# Altium project PowerSupply.PrjPcb (part 2 of 3)
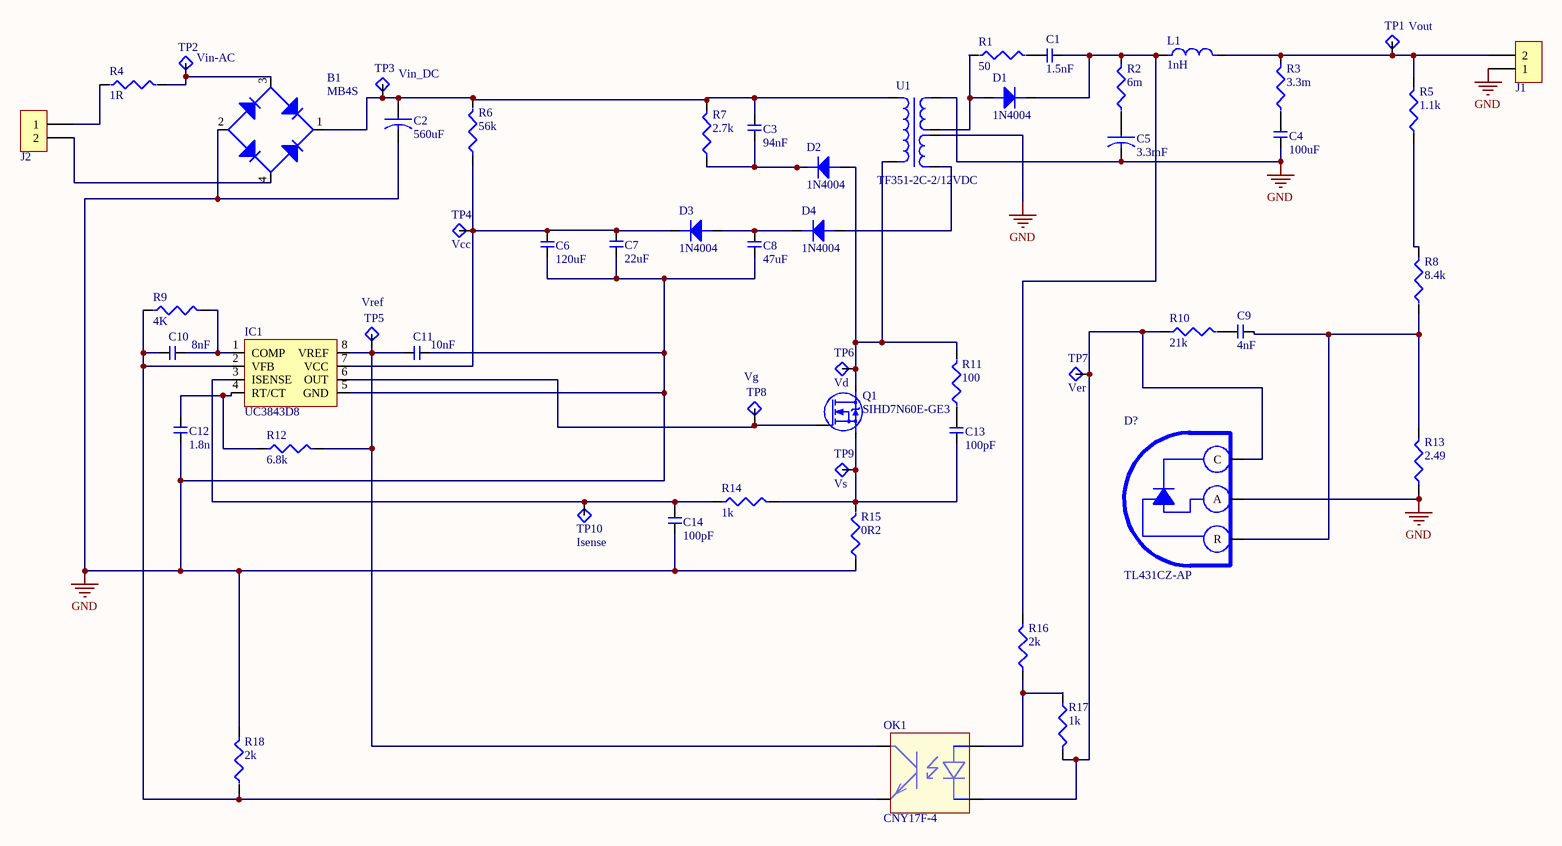
[diagram p1: PowerSupply.SchDoc]

## Sheet PowerSupply.SchDoc (continued)
### Library data of the parts
B1 = MB4S: Rectifier Bridge Diode Single 400V 0.5A 4-Pin SOIC N T/R / IC RECT BRIDGE 0.5A 400V 4SOIC; Manufacturer: ON Semiconductor / Fairchild; Supplier 1: Future Electronics; Manufacturer Part Number: MB4S; RoHS: Yes; Category: Rectifier Diodes; Stock 1: 6000; Pricing 1: 3000=0.114, 6000=0.111, 9000=0.11, 12000=0.109, 15000=0.106, 45000=0.106 (USD); Reverse Voltage: 400V; ComponentLink1URL: https://datasheet.ciiva.com/4433/mb4s-186124-4433195.pdf?src-supplier=Mouser; ComponentLink1Description: https://datasheet.ciiva.com/4433/mb4s-186124-4433195.pdf?src-supplier=Mouser; ComponentLink2URL: https://datasheet.ciiva.com/17038/mb4s-17038344.pdf?src-supplier=Future+Electronics; ComponentLink2Description: https://datasheet.ciiva.com/17038/mb4s-17038344.pdf?src-supplier=Future+Electronics; ComponentLink3URL: https://datasheet.ciiva.com/1197/1794557-1197746.pdf?src-supplier=Farnell; ComponentLink3Description: https://datasheet.ciiva.com/1197/1794557-1197746.pdf?src-supplier=Farnell; ComponentLink4URL: https://datasheet.ciiva.com/15145/getdatasheetpartid-117252-15145288.pdf?src-supplier=Verical; ComponentLink4Description: https://datasheet.ciiva.com/15145/getdatasheetpartid-117252-15145288.pdf?src-supplier=Verical; ComponentLink5URL: https://datasheet.ciiva.com/11195/mb8s-11195767.pdf?src-supplier=Avnet; ComponentLink5Description: https://datasheet.ciiva.com/11195/mb8s-11195767.pdf?src-supplier=Avnet; ComponentLink6URL: https://datasheet.ciiva.com/8018/1827136-8018971.pdf?src-supplier=Element14; ComponentLink6Description: https://datasheet.ciiva.com/8018/1827136-8018971.pdf?src-supplier=Element14; ComponentLink7URL: https://datasheet.ciiva.com/43505/974489-43505307.pdf?src-supplier=Jameco; ComponentLink7Description: https://datasheet.ciiva.com/43505/974489-43505307.pdf?src-supplier=Jameco; ComponentLink8URL: https://datasheet.ciiva.com/885/mb1s-885510.pdf?src-supplier=Digikey; ComponentLink8Description: https://datasheet.ciiva.com/885/mb1s-885510.pdf?src-supplier=Digikey; ComponentLink9URL: https://datasheet.ciiva.com/885/mb1s-885511.pdf?src-supplier=Digikey; ComponentLink9Description: https://datasheet.ciiva.com/885/mb1s-885511.pdf?src-supplier=Digikey; ComponentLink10URL: https://datasheet.ciiva.com/885/mb1s-885512.pdf?src-supplier=Digikey; ComponentLink10Description: https://datasheet.ciiva.com/885/mb1s-885512.pdf?src-supplier=Digikey; ComponentLink11URL: https://datasheet.ciiva.com/11195/mb8s-11195766.pdf?src-supplier=Avnet; ComponentLink11Description: https://datasheet.ciiva.com/11195/mb8s-11195766.pdf?src-supplier=Avnet
C1 = GRM21A5C2E152FWA1J: General Up to 125C Reflow soldering Flow soldering; Manufacturer: Murata; Supplier 1: Mouser; Manufacturer Part Number: GRM21A5C2E152FWA1J; RoHS: Yes; Category: Ceramic Capacitors; Stock 1: 9850; Pricing 1: 1=0.29, 10=0.206, 50=0.206, 100=0.124, 1000=0.078, 10000=0.064 (USD)
C2 = EEU-FM1C222: Aluminum Electrolytic Capacitor, Polarized, Aluminum (wet), 25V, 20% +Tol, 20% -Tol, 560uF; Manufacturer: Panasonic; Dissipation Factor: 18%; Voltage Rating (AC): 16V; Supplier 1: Mouser; Manufacturer Part Number: EEU-FM1C222; RoHS: Yes; Category: Aluminum Electrolytic Capacitors; Stock 1: 1570; Pricing 1: 1=1.04, 10=0.657, 50=0.657, 100=0.529, 1000=0.411, 10000=0.367 (USD); ComponentLink1URL: https://datasheet.ciiva.com/11778/0900766b805f3abe-11778660.pdf?src-supplier=Rs; ComponentLink1Description: https://datasheet.ciiva.com/11778/0900766b805f3abe-11778660.pdf?src-supplier=Rs; ComponentLink2URL: https://datasheet.ciiva.com/24023/a-e-461514-24023525.pdf?src-supplier=Mouser; ComponentLink2Description: https://datasheet.ciiva.com/24023/a-e-461514-24023525.pdf?src-supplier=Mouser; ComponentLink3URL: https://datasheet.ciiva.com/10685/aba0000ce108-10685660.pdf?src-supplier=Avnet; ComponentLink3Description: https://datasheet.ciiva.com/10685/aba0000ce108-10685660.pdf?src-supplier=Avnet; ComponentLink4URL: https://datasheet.ciiva.com/46371/26036-46371896.pdf?src-supplier=Element14; ComponentLink4Description: https://datasheet.ciiva.com/46371/26036-46371896.pdf?src-supplier=Element14; ComponentLink5URL: https://datasheet.ciiva.com/94/aba0000ce108-94216.pdf?src-supplier=Digi-Key; ComponentLink5Description: https://datasheet.ciiva.com/94/aba0000ce108-94216.pdf?src-supplier=Digi-Key; ComponentLink6URL: https://datasheet.ciiva.com/30235/aba0000ce108-30235055.pdf?src-supplier=Onlinecomponents.com; ComponentLink6Description: https://datasheet.ciiva.com/30235/aba0000ce108-30235055.pdf?src-supplier=Onlinecomponents.com; ComponentLink7URL: https://datasheet.ciiva.com/14601/70068540-14601135.pdf?src-supplier=Allied+Electronics; ComponentLink7Description: https://datasheet.ciiva.com/14601/70068540-14601135.pdf?src-supplier=Allied+Electronics; ComponentLink8URL: https://datasheet.ciiva.com/16210/aba0000ce108-16210090.pdf?src-supplier=Future+Electronics; ComponentLink8Description: https://datasheet.ciiva.com/16210/aba0000ce108-16210090.pdf?src-supplier=Future+Electronics
C3 = C1812C943KBGLCAUTO: Cap, AEC-Q200, 0.094UF, 630V, 1812;; Manufacturer: KEMET; Supplier 1: Mouser; Manufacturer Part Number: C1812C943KBGLCAUTO; RoHS: No; Stock 1: 405; Pricing 1: 1=3.57, 10=2.75, 50=2.48, 100=2.13, 1000=1.56, 10000=1.47 (USD)
C4 = GRM32ER60J107ME20L: Multilayer Ceramic Capacitor, 100 uF, 6.3 V, ± 20%, X5R, 1210 [3225 Metric]; Manufacturer: Murata; Voltage Rating: 6.3V; Supplier 1: Arrow Electronics; Manufacturer Part Number: GRM32ER60J107ME20L; RoHS: Yes; Category: Ceramic Capacitors; Stock 1: 177; Pricing 1: 1=1.4534, 10=1.0931, 25=0.9871, 100=0.5195 (USD); Mount: Surface Mount; Case/Package: 1210; Number of Pins: 2; Material: Ceramic; Case Code (Metric): 3225; Case Code (Imperial): 1210; Min Operating Temperature: -55°C; Max Operating Temperature: 85°C; Package Quantity: 1; Capacitance: 100uF; Tolerance: 20%; Packaging: Cut Tape; Voltage Rating (DC): 6.3V; Termination: SMD/SMT; Series: GRM; Voltage: 6.3V; Dielectric: X5R; Length: 3.2mm; Width: 0.098inch; Height: 2.5mm; Depth: 2.5mm; Thickness: 0.106inch; Lead Free: Lead Free; Reach SVHC Compliant: No; RoHS Compliant: Yes
C5 = EEU-FC1A332S: Cap Aluminum 3300uF 10V 20% (16 X 20mm) Radial 7.5mm 2205mA 5000h 105°C Bulk; Manufacturer: Panasonic; Ripple Current: 2.205A; Life (Hours): 5000Hour; Impedance: 29mR; Leakage Current: 3uA; Dissipation Factor: 0.19%; Lead Diameter: 0.8mm; Supplier 1: Mouser; Manufacturer Part Number: EEU-FC1A332S; RoHS: Yes; Category: Aluminum Electrolytic Capacitors; Stock 1: 15; Pricing 1: 1=1.36, 10=0.888, 50=0.888, 100=0.694, 1000=0.536, 10000=0.482 (USD); Mount: Through Hole,PCB; Case/Package: Radial; Min Operating Temperature: -55°C; Max Operating Temperature: 105°C; Capacitance: 3.3mF; Tolerance: 20%; Voltage Rating: 10V; Series: FC; Packaging: Bulk; Package Quantity: 100; Termination: Radial; Voltage Rating (DC): 10V; Voltage: 10V; Construction: RADIAL; ESR (Equivalent Series Resistance): 29mR; Diameter: 16mm; Length: 20mm; Height: 20mm; Lead Pitch: 7.5mm; Height - Seated (Max): 0.787inch; Radiation Hardening: No; RoHS Compliant: Yes; Reach SVHC Compliant: Unknown; Lead Free: Lead Free; ComponentLink1URL: https://datasheet.ciiva.com/11781/0900766b80becf93-11781127.pdf?src-supplier=Rs; ComponentLink1Description: https://datasheet.ciiva.com/11781/0900766b80becf93-11781127.pdf?src-supplier=Rs; ComponentLink2URL: https://datasheet.ciiva.com/7961/aba0000ce22-7961340.pdf?src-supplier=Element14; ComponentLink2Description: https://datasheet.ciiva.com/7961/aba0000ce22-7961340.pdf?src-supplier=Element14; ComponentLink3URL: https://datasheet.ciiva.com/43470/1790611-43470763.pdf?src-supplier=Farnell; ComponentLink3Description: https://datasheet.ciiva.com/43470/1790611-43470763.pdf?src-supplier=Farnell; ComponentLink4URL: https://datasheet.ciiva.com/46379/1790611-46379261.pdf?src-supplier=Element14; ComponentLink4Description: https://datasheet.ciiva.com/46379/1790611-46379261.pdf?src-supplier=Element14; ComponentLink5URL: https://datasheet.ciiva.com/24068/a-e-461514-24068731.pdf?src-supplier=Mouser; ComponentLink5Description: https://datasheet.ciiva.com/24068/a-e-461514-24068731.pdf?src-supplier=Mouser; ComponentLink6URL: https://datasheet.ciiva.com/14590/70068429-14590057.pdf?src-supplier=Allied+Electronics; ComponentLink6Description: https://datasheet.ciiva.com/14590/70068429-14590057.pdf?src-supplier=Allied+Electronics; ComponentLink7URL: https://datasheet.ciiva.com/11677/aba0000ce22-11677685.pdf?src-supplier=Avnet; ComponentLink7Description: https://datasheet.ciiva.com/11677/aba0000ce22-11677685.pdf?src-supplier=Avnet; ComponentLink8URL: https://datasheet.ciiva.com/15166/getdatasheetpartid-178475-15166218.pdf?src-supplier=Verical; ComponentLink8Description: https://datasheet.ciiva.com/15166/getdatasheetpartid-178475-15166218.pdf?src-supplier=Verical; ComponentLink9URL: https://datasheet.ciiva.com/30242/aba0000ce22-30242043.pdf?src-supplier=Onlinecomponents.com; ComponentLink9Description: https://datasheet.ciiva.com/30242/aba0000ce22-30242043.pdf?src-supplier=Onlinecomponents.com; ComponentLink10URL: https://datasheet.ciiva.com/29243/421921-da-01-en-elko-fc-3300uf-10v-105c-29243146.pdf?src-supplier=Conrad; ComponentLink10Description: https://datasheet.ciiva.com/29243/421921-da-01-en-elko-fc-3300uf-10v-105c-29243146.pdf?src-supplier=Conrad
C6 = 6TPE120MAZB: 120uF SMD Solid Polymer Tantalum Capacitor; 6.3 V dc +/-20%; POSCAP Series; Manufacturer: Panasonic; Life (Hours): 1000Hour; Supplier 1: Mouser; Manufacturer Part Number: 6TPE120MAZB; RoHS: Yes; Category: Polymer Capacitors; Stock 1: 2995; Pricing 1: 1=1.09, 10=0.797, 50=0.797, 100=0.631, 1000=0.45, 10000=0.39 (USD); ComponentLink1URL: https://datasheet.ciiva.com/22745/1734363-22745336.pdf?src-supplier=Element14; ComponentLink1Description: https://datasheet.ciiva.com/22745/1734363-22745336.pdf?src-supplier=Element14; ComponentLink2URL: https://datasheet.ciiva.com/25785/1734363-25785911.pdf?src-supplier=Farnell; ComponentLink2Description: https://datasheet.ciiva.com/25785/1734363-25785911.pdf?src-supplier=Farnell; ComponentLink3URL: https://datasheet.ciiva.com/24378/tpe-series-datasheet-24378493.pdf?src-supplier=Onlinecomponents.com; ComponentLink3Description: https://datasheet.ciiva.com/24378/tpe-series-datasheet-24378493.pdf?src-supplier=Onlinecomponents.com
C7 = GRM21BR60J226ME39L: Multilayer Ceramic Capacitors MLCC Surface Mount 0805 22uF 6.3 Volts X5R 20%; Manufacturer: Murata; Voltage Rating (DC): 6.3V; Supplier 1: Arrow Electronics; Manufacturer Part Number: GRM21BR60J226ME39L; RoHS: Yes; Category: Ceramic Capacitors; Stock 1: 282000; Pricing 1: 3000=0.0699, 6000=0.0677, 9000=0.054, 15000=0.039, 30000=0.037, 75000=0.033, 150000=0.0327 (USD); Mount: Surface Mount; Case/Package: 0805; Case Code (Metric): 2012; Case Code (Imperial): 0805; Material: Ceramic; Min Operating Temperature: -55°C; Max Operating Temperature: 85°C; Capacitance: 22uF; Tolerance: 20%; Packaging: Tape and Reel; Voltage Rating: 6.3V; Termination: SMD/SMT; Series: GRM; Construction: Flat; Package Quantity: 1; Voltage: 6.3V; Dielectric: X5R; Length: 2mm; Width: 0.049inch; Height: 1.25mm; Depth: 1.25mm; Thickness: 0.053inch; Radiation Hardening: No; Reach SVHC Compliant: No; Lead Free: Lead Free; RoHS Compliant: Yes
C8 = JMK212BJ476MG-T: Multilayer Ceramic Capacitors MLCC - SMD/SMT 47uF 6.3V X5R +/-20% 0805 Gen Purp; Manufacturer: Taiyo Yuden; Tolerance: 20%; Supplier 1: Avnet; Manufacturer Part Number: JMK212BJ476MG-T; RoHS: Yes; Category: Ceramic Capacitors; Stock 1: 159000; Pricing 1: 3000=0.11801, 6000=0.11536, 12000=0.11006, 18000=0.10741, 24000=0.10475 (USD); Mount: Surface Mount; Case/Package: 0805; Number of Pins: 2; Case Code (Metric): 2012; Case Code (Imperial): 0805; Min Operating Temperature: -55°C; Max Operating Temperature: 85°C; Capacitance: 47uF; Packaging: Tape and Reel; Series: M; Voltage Rating: 6.3V; Voltage Rating (DC): 6.3V; Termination: SMD/SMT; Construction: Flat; Dielectric: X5R; Length: 2mm; Height: 1.25mm; Depth: 1.25mm; Radiation Hardening: No; RoHS Compliant: Yes; Reach SVHC Compliant: Unknown; Lead Free: Lead Free
C9 = B72530T0060M062: Epcos CT Series Metal OxideVaristor 4nF 2.5A, Clamping 25V, Varistor 11V 1210 Case; Manufacturer: TDK EPCOS; Max Voltage Rating (AC): 6V; Max Voltage Rating (DC): 8V; Energy: 0.7J; Max Surge Current: 300A; Number of Circuits: 1; Min Varistor Voltage: 8.8V; Max Varistor Voltage: 13.2V; Supplier 1: Farnell; Manufacturer Part Number: B72530T0060M062; RoHS: Yes; Category: Varistors; Stock 1: 1532; Pricing 1: 5=5, 50=1.5, 250=1.26, 500=1.02, 1500=1 (EUR); Mount: Surface Mount; Case/Package: 1210; Size Code: 1210; Min Operating Temperature: -55°C; Max Operating Temperature: 125°C; Packaging: Tape and Reel; Series: -; Capacitance: 4nF; Clamping Voltage: 25V; Clamping Current: 2.5A; Varistor Voltage: 11V; Length: 3.2mm; Depth: 2.5mm; RoHS Compliant: Yes; ComponentLink1URL: https://datasheet.ciiva.com/26819/getdatasheetpartid-382608-26819931.pdf?src-supplier=Verical; ComponentLink1Description: https://datasheet.ciiva.com/26819/getdatasheetpartid-382608-26819931.pdf?src-supplier=Verical
C10 = C0805C103K2RACTU: Multilayer Ceramic Capacitor, 0.01 uF, 200 V, ± 10%, X7R, 0805 [2012 Metric]; Manufacturer: KEMET; Material: 4241ConductorMaterial; Voltage Rating (DC): 200V; Capacitance: 10nF; Dissipation Factor: 2.5%; Temperature Coefficient: 30ppm/°C; Supplier 1: Mouser; Manufacturer Part Number: C0805C103K2RACTU; RoHS: Yes; Category: Ceramic Capacitors; Stock 1: 28830; Pricing 1: 1=0.18, 10=0.128, 50=0.128, 100=0.06, 1000=0.035, 10000=0.026 (USD); Mount: Surface Mount; Case/Package: 0805; Number of Pins: 2; Case Code (Imperial): 0805; Case Code (Metric): 2012; Min Operating Temperature: -55°C; Max Operating Temperature: 125°C; Dielectric: X7R; Tolerance: 10%; Packaging: Tape and Reel; Termination: SMD/SMT; Voltage Rating: 200V; Package Quantity: 4000; Series: SMD Comm X7R; Construction: Flat; Length: 2mm; Width: 1.2mm; Height: 0.78mm; Depth: 1.25mm; Thickness: 0.035inch; Lead Pitch: 0.75mm; Radiation Hardening: No; RoHS Compliant: Yes; Reach SVHC Compliant: No; ComponentLink1URL: https://datasheet.ciiva.com/22700/1851736-22700517.pdf?src-supplier=Element14; ComponentLink1Description: https://datasheet.ciiva.com/22700/1851736-22700517.pdf?src-supplier=Element14; ComponentLink2URL: https://datasheet.ciiva.com/28672/1851736-28672827.pdf?src-supplier=Element14; ComponentLink2Description: https://datasheet.ciiva.com/28672/1851736-28672827.pdf?src-supplier=Element14
C11 = C0805C103K2RACTU: Multilayer Ceramic Capacitor, 0.01 uF, 200 V, ± 10%, X7R, 0805 [2012 Metric]; Manufacturer: KEMET; Material: 4241ConductorMaterial; Voltage Rating (DC): 200V; Dissipation Factor: 2.5%; Temperature Coefficient: 30ppm/°C; Supplier 1: Mouser; Manufacturer Part Number: C0805C103K2RACTU; RoHS: Yes; Category: Ceramic Capacitors; Stock 1: 28830; Pricing 1: 1=0.18, 10=0.128, 50=0.128, 100=0.06, 1000=0.035, 10000=0.026 (USD); Mount: Surface Mount; Case/Package: 0805; Number of Pins: 2; Case Code (Imperial): 0805; Case Code (Metric): 2012; Min Operating Temperature: -55°C; Max Operating Temperature: 125°C; Dielectric: X7R; Capacitance: 10nF; Tolerance: 10%; Packaging: Tape and Reel; Termination: SMD/SMT; Voltage Rating: 200V; Package Quantity: 4000; Series: SMD Comm X7R; Construction: Flat; Length: 2mm; Width: 1.2mm; Height: 0.78mm; Depth: 1.25mm; Thickness: 0.035inch; Lead Pitch: 0.75mm; Radiation Hardening: No; RoHS Compliant: Yes; Reach SVHC Compliant: No; ComponentLink1URL: https://datasheet.ciiva.com/22700/1851736-22700517.pdf?src-supplier=Element14; ComponentLink1Description: https://datasheet.ciiva.com/22700/1851736-22700517.pdf?src-supplier=Element14; ComponentLink2URL: https://datasheet.ciiva.com/28672/1851736-28672827.pdf?src-supplier=Element14; ComponentLink2Description: https://datasheet.ciiva.com/28672/1851736-28672827.pdf?src-supplier=Element14
C12 = GRM1885C1H112JA01D: Multilayer Ceramic Capacitor, 1100 pF, 50 V, ± 5%, C0G (NP0), 0603 [1608 Metric]; Manufacturer: Murata; Temperature Coefficient: 30ppm/°C; Supplier 1: Arrow Electronics; Manufacturer Part Number: GRM1885C1H112JA01D; RoHS: Yes; Category: Ceramic Capacitors; Stock 1: 40000; Pricing 1: 4000=0.0091, 8000=0.0082, 24000=0.0072, 100000=0.0055 (USD); ComponentLink1URL: https://datasheet.ciiva.com/133/product-133472.pdf?src-supplier=Digikey; ComponentLink1Description: https://datasheet.ciiva.com/133/product-133472.pdf?src-supplier=Digikey; ComponentLink2URL: https://datasheet.ciiva.com/11621/product-11621253.pdf?src-supplier=Avnet; ComponentLink2Description: https://datasheet.ciiva.com/11621/product-11621253.pdf?src-supplier=Avnet; ComponentLink3URL: https://datasheet.ciiva.com/133/partnumbering-e-01-133471.pdf?src-supplier=Digikey; ComponentLink3Description: https://datasheet.ciiva.com/133/partnumbering-e-01-133471.pdf?src-supplier=Digikey; ComponentLink4URL: https://datasheet.ciiva.com/133/partnumbering-e-01-133473.pdf?src-supplier=Digikey; ComponentLink4Description: https://datasheet.ciiva.com/133/partnumbering-e-01-133473.pdf?src-supplier=Digikey
C13 C14 = GRM1555C1H101JA01D: Multilayer Ceramic Capacitor, 100 pF, 50 V, ± 5%, C0G (NP0), 0402 [1005 Metric]; Manufacturer: Murata; Voltage Rating: 50V; Supplier 1: Arrow Electronics; Manufacturer Part Number: GRM1555C1H101JA01D; RoHS: Yes; Category: Ceramic Capacitors; Stock 1: 6040000; Pricing 1: 10000=0.004, 20000=0.0035, 30000=0.0034, 50000=0.003, 100000=0.0024, 250000=0.002 (USD); Mount: Surface Mount; Case/Package: 0402; Material: Ceramic; Case Code (Metric): 1005; Case Code (Imperial): 0402; Min Operating Temperature: -55°C; Max Operating Temperature: 125°C; Tolerance: 5%; Capacitance: 100pF; Packaging: Tape and Reel; Package Quantity: 1; Voltage Rating (DC): 50V; Dielectric: C0G; Termination: SMD/SMT; Series: GRM; Construction: Flat; Voltage: 50V; Length: 1mm; Width: 0.02inch; Height: 0.5mm; Depth: 0.5mm; Thickness: 0.022inch; Radiation Hardening: No; Lead Free: Lead Free; RoHS Compliant: Yes; Reach SVHC Compliant: No
D1-D4 = 1N4004: Rectifier Diode, 1 Element, 1A, 400V V(RRM), Silicon, DO-41; Manufacturer: Diotec; Supplier 1: Mouser; Manufacturer Part Number: 1N4004; RoHS: Yes; Category: Rectifier Diodes; Stock 1: 64524; Pricing 1: 1=0.1, 10=0.068, 50=0.068, 100=0.057, 1000=0.039, 10000=0.019 (USD); ComponentLink1URL: https://datasheet.ciiva.com/18711/1n400x-eng-tds-18711215.pdf?src-supplier=Distrelec; ComponentLink1Description: https://datasheet.ciiva.com/18711/1n400x-eng-tds-18711215.pdf?src-supplier=Distrelec; ComponentLink2URL: https://datasheet.ciiva.com/29316/162248-da-01-ml-1n4004-silizium-diode-de-en-29316437.pdf?src-supplier=Conrad; ComponentLink2Description: https://datasheet.ciiva.com/29316/162248-da-01-ml-1n4004-silizium-diode-de-en-29316437.pdf?src-supplier=Conrad
D? = TL431CZ-AP: V-Ref Adjustable 2.495V to 36V 100mA 3-Pin TO-92 Ammo; Manufacturer: STMicroelectronics; Max Input Voltage: 37V; Reference Type: Shunt,Adjustable; Tolerance: 2.21%; Cathode Current: 1mA; Temperature Coefficient: 100ppm/°C; Number of Channels: 1; Accuracy: 2%; Output Impedance: 500mR; Supplier 1: Mouser; Manufacturer Part Number: TL431CZ-AP; RoHS: Yes; Category: Voltage References; Stock 1: 652; Pricing 1: 1=0.46, 10=0.341, 50=0.341, 100=0.23, 1000=0.143, 10000=0.116 (USD); Mount: Through Hole; Case/Package: TO-92; Min Operating Temperature: 0°C; Max Operating Temperature: 70°C; Packaging: Cut Tape; Max Output Voltage: 36V; Series: -; Package Quantity: 2000; Max Output Current: 100mA; Reference Voltage: 2.495V; Output Voltage: 36V; Output Current: 100mA; Min Output Voltage: 2.495V; Output Type: Adjustable; Supply Current: 100mA; RoHS Compliant: Yes; Lead Free: Lead Free; ComponentLink1URL: https://datasheet.ciiva.com/4909/cd00000986-4909435.pdf?src-supplier=Mouser; ComponentLink1Description: https://datasheet.ciiva.com/4909/cd00000986-4909435.pdf?src-supplier=Mouser; ComponentLink2URL: https://datasheet.ciiva.com/2011/cd00000986-2011433.pdf?src-supplier=Digikey; ComponentLink2Description: https://datasheet.ciiva.com/2011/cd00000986-2011433.pdf?src-supplier=Digikey
IC1 = UC3843D8: Single ended 500KHz current mode PWM controller with 8.4V/7.6V UVLO 100% duty cycle, 0C to 70C 8-SOIC 0 to 70; Manufacturer: Texas Instruments; Topology: Buck-Boost,Flyback; Output Current: 1A; Output Voltage: 5V; Number of Outputs: 1; Rise Time: 50ns; Max Supply Voltage: 30V; Quiescent Current: 11mA; Frequency: 450kHz; Power Dissipation: 650mW; Min Supply Voltage: 12V; Supplier 1: Mouser; Manufacturer Part Number: UC3843D8; RoHS: Yes; Category: Voltage Regulators - Switching; Stock 1: 471; Pricing 1: 1=1.57, 10=1.33, 50=1.33, 100=1.02, 1000=0.901, 10000=0.624 (USD); Case/Package: D; Number of Pins: 8; Weight: 0.002561oz; Min Operating Temperature: 0°C; Max Operating Temperature: 70°C; Packaging: Rail/Tube; Switching Frequency: 500kHz; Max Duty Cycle: 100%; Package Quantity: 75; Series: -; Fall Time: 50ns; Duty Cycle: 100%; Input Current: 11mA; Max Frequency: 500kHz; Operating Supply Current: 11mA; Radiation Hardening: No; RoHS Compliant: Yes; Lead Free: Lead Free; Reach SVHC Compliant: No; ComponentLink1URL: https://datasheet.ciiva.com/15108/getdatasheetpartid-234476-15108333.pdf?src-supplier=Verical; ComponentLink1Description: https://datasheet.ciiva.com/15108/getdatasheetpartid-234476-15108333.pdf?src-supplier=Verical; ComponentLink2URL: https://datasheet.ciiva.com/41463/001015242-da-01-en-ic-reg-ctrlr-pwm-cm-uc3843d8-soic-8-tid-41463081.pdf?src-supplier=Conrad; ComponentLink2Description: https://datasheet.ciiva.com/41463/001015242-da-01-en-ic-reg-ctrlr-pwm-cm-uc3843d8-soic-8-tid-41463081.pdf?src-supplier=Conrad; ComponentLink3URL: https://datasheet.ciiva.com/1513/1863689-1513191.pdf?src-supplier=Element14; ComponentLink3Description: https://datasheet.ciiva.com/1513/1863689-1513191.pdf?src-supplier=Element14; ComponentLink4URL: https://datasheet.ciiva.com/2015/uc3842-2015741.pdf?src-supplier=Digikey; ComponentLink4Description: https://datasheet.ciiva.com/2015/uc3842-2015741.pdf?src-supplier=Digikey; ComponentLink5URL: https://datasheet.ciiva.com/14264/slus223c-14264762.pdf?src-supplier=Avnet; ComponentLink5Description: https://datasheet.ciiva.com/14264/slus223c-14264762.pdf?src-supplier=Avnet
J1 J2 = 2 wire-to-board connector: MC 1,5/ 2-G-3,81 P26 THR - Wire-To-Board Connector, Horizontal, 3.81 mm, 2 Contacts, Header, MC Series, Through Hole, 1 Rows; Manufacturer: PHOENIX CONTACT; Current Rating: 8 A; Number of Positions: 2 Position; Voltage Rating: 160 V; Pitch: 3.81 mm; Supplier 1: Mouser; Manufacturer Part Number: MC 1,5/ 2-G-3,81 P26 THR; RoHS: RoHS Compliant; Category: Wire-To-Board Connectors; Stock 1: 1.987; Pricing 1: 1=0.180, 10=0.125, 100=0.103, 500=0.099, 1000=0.081, 2000=0.074, 5000=0.066, 10000=0.062, 25000=0.057 (USD); Contact Plating: Tin Plated Contacts; Housing Material: Thermoplastic; Mounting Angle: Horizontal; Number of Rows: 1 Row; Operating Temperature Range: - 65 C to + 125 C; Packaging: Bulk; Product: Headers; Series: MC Series; Termination Style: Through Hole; Brand: PHOENIX CONTACT; Contact Material: Tin; Flammability Rating: UL 94 V-0; Mounting Style: Through Hole; Contact Gender: Pin (Male); Product Category: Wire-To-Board Connectors; Standard Pack Qty: 1000; Termination Post Length: 3.05 mm; RoHS - Mouser: Y; Reeling: False; ComponentLink: http://ro.farnell.com/phoenix-contact/mc-1-5-2-g-3-81-p26-thr/header-horizontal-3-81mm-2way/dp/1792936; Supplier 2: Digi-Key; Supplier Part Number 1: 649-77311-118-02LF; Supplier Part Number 2: 609-4434-ND; Supplier: Farnell; Supplier Part Number: 1792936
L1 = LQG15HS1N0S02D: Inductor RF Chip Multi-Layer 1nH 0.3nH 100MHz 8Q-Factor Air 1A 70mOhm DCR 0402 T/R; Manufacturer: Murata; Current Rating: 300mA; Shielding: Unshielded; Self Resonant Frequency: 10GHz; DC Resistance (DCR): 70mR; Q Factor: 8; Supplier 1: Arrow Electronics; Manufacturer Part Number: LQG15HS1N0S02D; RoHS: Yes; Category: Fixed Inductors; Stock 1: 20000; Pricing 1: 10000=0.0155, 30000=0.0152, 50000=0.0151 (USD); Mount: Surface Mount; Case/Package: 0402; Case Code (Metric): 1005; Case Code (Imperial): 0402; Core Material: Air; Min Operating Temperature: -55°C; Max Operating Temperature: 125°C; Inductance: 1nH; Packaging: Tape and Reel; Test Frequency: 100MHz; Series: LQG15HS; Package Quantity: 1; Max DC Current: 300mA; Termination: SMD/SMT; DC Current: 300mA; Rated Current-Max: 300mA; Length: 1mm; Width: 0.02inch; Height: 0.5mm; Height - Seated (Max): 0.022inch; Depth: 0.55mm; Radiation Hardening: No; RoHS Compliant: Yes; Military Standard: Not; Lead Free: Lead Free; ComponentLink1URL: https://datasheet.ciiva.com/11799/0900766b8090d53b-11799750.pdf?src-supplier=Rs; ComponentLink1Description: https://datasheet.ciiva.com/11799/0900766b8090d53b-11799750.pdf?src-supplier=Rs; ComponentLink2URL: https://datasheet.ciiva.com/27054/1864353-27054316.pdf?src-supplier=Jameco; ComponentLink2Description: https://datasheet.ciiva.com/27054/1864353-27054316.pdf?src-supplier=Jameco; ComponentLink3URL: https://datasheet.ciiva.com/1038/l0075s0083lqg15hs-1038134.pdf?src-supplier=Digikey; ComponentLink3Description: https://datasheet.ciiva.com/1038/l0075s0083lqg15hs-1038134.pdf?src-supplier=Digikey; ComponentLink4URL: https://datasheet.ciiva.com/1038/l0075s0083lqg15hs-1038133.pdf?src-supplier=Digikey; ComponentLink4Description: https://datasheet.ciiva.com/1038/l0075s0083lqg15hs-1038133.pdf?src-supplier=Digikey; ComponentLink5URL: https://datasheet.ciiva.com/1038/l0075s0083lqg15hs-1038135.pdf?src-supplier=Digikey; ComponentLink5Description: https://datasheet.ciiva.com/1038/l0075s0083lqg15hs-1038135.pdf?src-supplier=Digikey; ComponentLink6URL: https://datasheet.ciiva.com/4979/o05e-4979757.pdf?src-supplier=Mouser; ComponentLink6Description: https://datasheet.ciiva.com/4979/o05e-4979757.pdf?src-supplier=Mouser; ComponentLink7URL: https://datasheet.ciiva.com/3082/l0075s0083lqg15hs-3082177.pdf?src-supplier=Avnet; ComponentLink7Description: https://datasheet.ciiva.com/3082/l0075s0083lqg15hs-3082177.pdf?src-supplier=Avnet
OK1 = CNY17F-4: VISHAY CNY17F-4 Transistor Output Optocoupler, 1 Channel, DIP, 6 Pins, 60 mA, 5 kV, 160 %; Manufacturer: Vishay Semiconductors; Supplier 1: Mouser; Manufacturer Part Number: CNY17F-4; RoHS: No; Category: Optocouplers; Stock 1: 2627; Pricing 1: 1=0.66, 10=0.437, 50=0.437, 100=0.289, 1000=0.228, 10000=0.19 (USD)
Q1 = SIHD7N60E-GE3: MOSFET N-CH 600V 7A TO-252; Manufacturer: Vishay Siliconix; Supplier 1: Mouser; Manufacturer Part Number: SIHD7N60E-GE3; RoHS: Yes; Category: MOSFETs; Stock 1: 503; Pricing 1: 1=1.93, 10=1.56, 50=1.56, 100=1.26, 1000=0.871, 10000=0.81 (USD); ComponentLink1URL: https://datasheet.ciiva.com/23724/sihd7n60e-23724242.pdf?src-supplier=Newark; ComponentLink1Description: https://datasheet.ciiva.com/23724/sihd7n60e-23724242.pdf?src-supplier=Newark; ComponentLink2URL: https://datasheet.ciiva.com/8024/sihd7n60e-8024248.pdf?src-supplier=Element14; ComponentLink2Description: https://datasheet.ciiva.com/8024/sihd7n60e-8024248.pdf?src-supplier=Element14; ComponentLink3URL: https://datasheet.ciiva.com/6385/sihd7n60e-6385853.pdf?src-supplier=Digikey; ComponentLink3Description: https://datasheet.ciiva.com/6385/sihd7n60e-6385853.pdf?src-supplier=Digikey
R1 = CRCW060350R0FKEA: SMD Chip Resistor, 50 Ohm, ± 1%, 100 mW, 0603 [1608 Metric], Thick Film, General Purpose; Manufacturer: Vishay Dale; Power Rating: 100mW; Resistance: 50R; Voltage Rating: 75V; Temperature Coefficient: 100ppm/°C; Supplier 1: Mouser; Manufacturer Part Number: CRCW060350R0FKEA; RoHS: Yes; Category: Chip SMD Resistors; Stock 1: 142146; Pricing 1: 1=0.1, 10=0.028, 50=0.028, 100=0.017, 1000=0.011, 10000=0.009 (USD); Case/Package: 0603; Number of Pins: 2; Case Code (Metric): 1608; Case Code (Imperial): 0603; Weight: 7.1E-05oz; Contact Plating: Tin; Size Code: 0603; Min Operating Temperature: -55°C; Max Operating Temperature: 155°C; Tolerance: 1%; Packaging: Tape and Reel; Series: CRCW; Termination: SMD/SMT; Package Quantity: 5000; Max Power Dissipation: 100mW; Number of Terminations: 2; Voltage Rating (DC): 75V; Features: Automotive AEC-Q200; Technology: THICK FILM; Resistor Type: Thick Film; Resistance Tolerance: 1%; Length: 1.55mm; Width: 0.85mm; Height: 0.45mm; Depth: 0.85mm; Radiation Hardening: No; RoHS Compliant: Yes; Lead Free: Lead Free; Reach SVHC Compliant: No; ComponentLink1URL: https://datasheet.ciiva.com/7657/1786679-7657103.pdf?src-supplier=Element14; ComponentLink1Description: https://datasheet.ciiva.com/7657/1786679-7657103.pdf?src-supplier=Element14; ComponentLink2URL: https://datasheet.ciiva.com/7792/1359338-7792320.pdf?src-supplier=Element14; ComponentLink2Description: https://datasheet.ciiva.com/7792/1359338-7792320.pdf?src-supplier=Element14; ComponentLink3URL: https://datasheet.ciiva.com/22665/1697183-22665684.pdf?src-supplier=Element14; ComponentLink3Description: https://datasheet.ciiva.com/22665/1697183-22665684.pdf?src-supplier=Element14; ComponentLink4URL: https://datasheet.ciiva.com/6195/dcrcwe3-6195095.pdf?src-supplier=Farnell; ComponentLink4Description: https://datasheet.ciiva.com/6195/dcrcwe3-6195095.pdf?src-supplier=Farnell; ComponentLink5URL: https://datasheet.ciiva.com/16720/70201119-16720645.pdf?src-supplier=Allied+Electronics; ComponentLink5Description: https://datasheet.ciiva.com/16720/70201119-16720645.pdf?src-supplier=Allied+Electronics; ComponentLink6URL: https://datasheet.ciiva.com/5550/dcrcwe3-109170-5550010.pdf?src-supplier=Mouser; ComponentLink6Description: https://datasheet.ciiva.com/5550/dcrcwe3-109170-5550010.pdf?src-supplier=Mouser; ComponentLink7URL: https://datasheet.ciiva.com/6195/1359338-6195078.pdf?src-supplier=Farnell; ComponentLink7Description: https://datasheet.ciiva.com/6195/1359338-6195078.pdf?src-supplier=Farnell; ComponentLink8URL: https://datasheet.ciiva.com/16784/70201119-16784459.pdf?src-supplier=Allied+Electronics; ComponentLink8Description: https://datasheet.ciiva.com/16784/70201119-16784459.pdf?src-supplier=Allied+Electronics; ComponentLink9URL: https://datasheet.ciiva.com/16494/dcrcwe3-16494475.pdf?src-supplier=Future+Electronics; ComponentLink9Description: https://datasheet.ciiva.com/16494/dcrcwe3-16494475.pdf?src-supplier=Future+Electronics
R2 = PA0603FRM570R006L: Resistor Current Sense Metal Substrate 0603 6mOhm ±1% 1/2W ±50ppm/°C Paper T/R Automotive; Manufacturer: Yageo; Supplier 1: Digikey; Manufacturer Part Number: PA0603FRM570R006L; Category: Chip SMD Resistors; Pricing 1: 5000=0.10194 (USD); ComponentLink1URL: https://datasheet.octopart.com/PA0603FRM570R006L-Yageo-datasheet-86814980.pdf; ComponentLink1Description: https://datasheet.octopart.com/PA0603FRM570R006L-Yageo-datasheet-86814980.pdf
R3 = CRGCQ0603J3M3: SMD Chip Resistor, 3.3 MOhm, ± 5%, 100 mW, 0603 [1608 Metric], Thick Film, General Purpose; Manufacturer: TE Connectivity; Voltage Rating: 75V; Power Rating: 100mW; Supplier 1: Arrow Electronics; Manufacturer Part Number: CRGCQ0603J3M3; Category: Chip SMD Resistors; Stock 1: 5000; Pricing 1: 1=0.004, 10=0.0037, 25=0.0033, 100=0.003, 250=0.0027, 500=0.0024, 1000=0.002, 3000=0.0017 (USD); Voltage Rating (DC): 75V; Operating Supply Voltage: 75V; Height: 550um; ComponentLink1URL: https://4donline.ihs.com/images/VipMasterIC/IC/TYEL/TYEL-S-A0004929575/TYEL-S-A0004929575-1.pdf?hkey=52A5661711E402568146F3353EA87419&src-supplier=Farnell; ComponentLink1Description: https://4donline.ihs.com/images/VipMasterIC/IC/TYEL/TYEL-S-A0004929575/TYEL-S-A0004929575-1.pdf?hkey=52A5661711E402568146F3353EA87419&src-supplier=Farnell; ComponentLink2URL: https://www.te.com/commerce/DocumentDelivery/DDEController?Action=srchrtrv&DocNm=1773204-3&DocType=DS&DocLang=English&src-supplier=Digikey; ComponentLink2Description: https://www.te.com/commerce/DocumentDelivery/DDEController?Action=srchrtrv&DocNm=1773204-3&DocType=DS&DocLang=English&src-supplier=Digikey; ComponentLink3URL: https://www.te.com/commerce/DocumentDelivery/DDEController?Action=srchrtrv&amp;DocNm=1773204-3&amp;DocType=DS&amp;DocLang=English&src-supplier=Digikey; ComponentLink3Description: https://www.te.com/commerce/DocumentDelivery/DDEController?Action=srchrtrv&amp;DocNm=1773204-3&amp;DocType=DS&amp;DocLang=English&src-supplier=Digikey; ComponentLink4URL: https://4donline.ihs.com/images/VipMasterIC/IC/TYEL/TYEL-S-A0004929575/TYEL-S-A0004929575-1.pdf?hkey=52A5661711E402568146F3353EA87419&src-supplier=Newark; ComponentLink4Description: https://4donline.ihs.com/images/VipMasterIC/IC/TYEL/TYEL-S-A0004929575/TYEL-S-A0004929575-1.pdf?hkey=52A5661711E402568146F3353EA87419&src-supplier=Newark; ComponentLink5URL: https://datasheet.octopart.com/CRGCQ0603J3M3-TE-Connectivity-datasheet-114679081.pdf?src-supplier=Master+Electronics; ComponentLink5Description: https://datasheet.octopart.com/CRGCQ0603J3M3-TE-Connectivity-datasheet-114679081.pdf?src-supplier=Master+Electronics
R4 = ERJ-2GEJ1R0X: Res Thick Film 0402 1 Ohm 5% 1/10W -100ppm/ to 600|; Manufacturer: Panasonic; Voltage Rating (DC): 50V; Power Rating: 100mW; Temperature Coefficient: 600ppm/°C; Supplier 1: Mouser; Manufacturer Part Number: ERJ-2GEJ1R0X; RoHS: Yes; Category: Chip SMD Resistors; Stock 1: 285934; Pricing 1: 1=0.1, 10=0.024, 50=0.024, 100=0.009, 1000=0.004, 10000=0.003 (USD); Mount: Surface Mount; Case/Package: 0402; Case Code (Imperial): 0402; Case Code (Metric): 1005; Contact Plating: Tin; Size Code: 0402; Min Operating Temperature: -55°C; Max Operating Temperature: 155°C; Tolerance: 5%; Packaging: Tape and Reel; Package Quantity: 1; Termination: SMD/SMT; Series: ERJ; Resistance: 1R; Voltage Rating: 50V; Resistor Type: Thick Film; Number of Terminations: 2; Max Power Dissipation: 100mW; Features: Automotive AEC-Q200; Resistance Tolerance: 5%; Construction: Rectangular; Technology: THICK FILM; Length: 1mm; Width: 0.5mm; Height: 0.35mm; Depth: 0.5mm; Ratings: AEC-Q200; Radiation Hardening: No; Reach SVHC Compliant: No; RoHS Compliant: Yes; Lead Free: Lead Free; Military Standard: Not; ComponentLink1URL: https://datasheet.ciiva.com/34303/1986844-34303545.pdf?src-supplier=Jameco; ComponentLink1Description: https://datasheet.ciiva.com/34303/1986844-34303545.pdf?src-supplier=Jameco; ComponentLink2URL: https://datasheet.ciiva.com/11821/0900766b80f806dd-11821226.pdf?src-supplier=Rs; ComponentLink2Description: https://datasheet.ciiva.com/11821/0900766b80f806dd-11821226.pdf?src-supplier=Rs; ComponentLink3URL: https://datasheet.ciiva.com/43460/1500035-43460348.pdf?src-supplier=Farnell; ComponentLink3Description: https://datasheet.ciiva.com/43460/1500035-43460348.pdf?src-supplier=Farnell; ComponentLink4URL: https://datasheet.ciiva.com/46389/1500035-46389755.pdf?src-supplier=Element14; ComponentLink4Description: https://datasheet.ciiva.com/46389/1500035-46389755.pdf?src-supplier=Element14; ComponentLink5URL: https://datasheet.ciiva.com/6138/1500035-6138734.pdf?src-supplier=Farnell; ComponentLink5Description: https://datasheet.ciiva.com/6138/1500035-6138734.pdf?src-supplier=Farnell; ComponentLink6URL: https://datasheet.ciiva.com/46377/1500035-46377671.pdf?src-supplier=Element14; ComponentLink6Description: https://datasheet.ciiva.com/46377/1500035-46377671.pdf?src-supplier=Element14; ComponentLink7URL: https://datasheet.ciiva.com/28547/1678796-28547147.pdf?src-supplier=Element14; ComponentLink7Description: https://datasheet.ciiva.com/28547/1678796-28547147.pdf?src-supplier=Element14; ComponentLink8URL: https://datasheet.ciiva.com/24068/aoa0000ce1-37422-24068837.pdf?src-supplier=Mouser; ComponentLink8Description: https://datasheet.ciiva.com/24068/aoa0000ce1-37422-24068837.pdf?src-supplier=Mouser; ComponentLink9URL: https://datasheet.ciiva.com/16758/70260739-16758282.pdf?src-supplier=Allied+Electronics; ComponentLink9Description: https://datasheet.ciiva.com/16758/70260739-16758282.pdf?src-supplier=Allied+Electronics; ComponentLink10URL: https://datasheet.ciiva.com/16772/70260739-16772860.pdf?src-supplier=Allied+Electronics; ComponentLink10Description: https://datasheet.ciiva.com/16772/70260739-16772860.pdf?src-supplier=Allied+Electronics; ComponentLink11URL: https://datasheet.ciiva.com/9198/aoa0000ce1-9198901.pdf?src-supplier=Avnet; ComponentLink11Description: https://datasheet.ciiva.com/9198/aoa0000ce1-9198901.pdf?src-supplier=Avnet; ComponentLink12URL: https://datasheet.ciiva.com/48530/aoa0000ce1-48530951.pdf?src-supplier=Avnet; ComponentLink12Description: https://datasheet.ciiva.com/48530/aoa0000ce1-48530951.pdf?src-supplier=Avnet; ComponentLink13URL: https://datasheet.ciiva.com/30245/4aoa0000ce1-30245805.pdf?src-supplier=Onlinecomponents.com; ComponentLink13Description: https://datasheet.ciiva.com/30245/4aoa0000ce1-30245805.pdf?src-supplier=Onlinecomponents.com
R5 = 302-1.1K-RC: Thick Film Resistors 1/10WATT 1.1KOHMS; Manufacturer: Xicon; Resistance: 1.1kR; Power Rating: 100mW; Tolerance: 1%; Voltage Rating: 50V; Temperature Coefficient: 200ppm/°C; Supplier 1: Mouser; Manufacturer Part Number: 302-1.1K-RC; RoHS: Yes; Category: Uncategorized; Case/Package: 0603; Case Code (Imperial): 0603; Case Code (Metric): 1608; Min Operating Temperature: -55°C; Max Operating Temperature: 125°C; Packaging: Tape and Reel; Package Quantity: 5000; Termination: SMD/SMT; Series: CR1-RC; Resistor Type: Thick Film; Length: 1.6mm; Width: 0.8mm; Height: 0.45mm; RoHS Compliant: Yes; ComponentLink1URL: http://www.mouser.com/ds/2/351/XC-600037-204249.pdf?src-supplier=Mouser; ComponentLink1Description: http://www.mouser.com/ds/2/351/XC-600037-204249.pdf?src-supplier=Mouser
R6 = RC0603FR-0756KL: SMD Chip Resistor, 56 kOhm, ± 1%, 100 mW, 0603 [1608 Metric], Thick Film, General Purpose; Manufacturer: Yageo; Resistance: 56kR; Power Rating: 100mW; Voltage Rating: 75V; Temperature Coefficient: 100ppm/°C; Voltage Rating (DC): 50V; Supplier 1: Future Electronics; Manufacturer Part Number: RC0603FR-0756KL; RoHS: Yes; Category: Chip SMD Resistors; Stock 1: 8005000; Pricing 1: 5000=0.0015, 75000=0.0014, 200000=0.0013, 500000=0.0013, 1250000=0.0012 (USD); Case/Package: 0603; Number of Pins: 2; Case Code (Metric): 1608; Case Code (Imperial): 0603; Weight: 7.1E-05oz; Size Code: 0603; Min Operating Temperature: -55°C; Max Operating Temperature: 155°C; Tolerance: 1%; Packaging: Tape and Reel; Resistor Type: Thick Film; Termination: SMD/SMT; Series: RC; Number of Terminations: 2; Max Power Dissipation: 100mW; Features: Moisture Resistant; Resistance Tolerance: 1%; Construction: Rectangular; Voltage Rating (AC): 50V; Length: 1.6mm; Width: 0.8mm; Height: 0.45mm; Depth: 0.8mm; RoHS Compliant: Yes; Military Standard: Not; Reach SVHC Compliant: Unknown; Lead Free: 5697LeadFree; ComponentLink1URL: https://datasheet.ciiva.com/2508/pyu-r-int-thick-7-2508519.pdf?src-supplier=Digikey; ComponentLink1Description: https://datasheet.ciiva.com/2508/pyu-r-int-thick-7-2508519.pdf?src-supplier=Digikey; ComponentLink2URL: https://datasheet.ciiva.com/2508/pyu-r-int-thick-7-2508520.pdf?src-supplier=Digikey; ComponentLink2Description: https://datasheet.ciiva.com/2508/pyu-r-int-thick-7-2508520.pdf?src-supplier=Digikey; ComponentLink3URL: https://datasheet.ciiva.com/7746/443971-7746377.pdf?src-supplier=Element14; ComponentLink3Description: https://datasheet.ciiva.com/7746/443971-7746377.pdf?src-supplier=Element14; ComponentLink4URL: https://datasheet.ciiva.com/15189/getdatasheetpartid-329310-15189781.pdf?src-supplier=Verical; ComponentLink4Description: https://datasheet.ciiva.com/15189/getdatasheetpartid-329310-15189781.pdf?src-supplier=Verical; ComponentLink5URL: https://datasheet.ciiva.com/2508/pyu-r-int-thick-7-2508518.pdf?src-supplier=Digikey; ComponentLink5Description: https://datasheet.ciiva.com/2508/pyu-r-int-thick-7-2508518.pdf?src-supplier=Digikey; ComponentLink6URL: https://datasheet.ciiva.com/7746/443971-7746376.pdf?src-supplier=Element14; ComponentLink6Description: https://datasheet.ciiva.com/7746/443971-7746376.pdf?src-supplier=Element14
R7 = ERA-3AEB272V: Res Thin Film 0603 2.7K Ohm 0.1% 0.1W ±25ppm/°C Molded SMD Punched Carrier T/R; Manufacturer: Panasonic; Voltage Rating (DC): 75V; Supplier 1: Mouser; Manufacturer Part Number: ERA-3AEB272V; RoHS: Yes; Category: Chip SMD Resistors; Stock 1: 90174; Pricing 1: 1=0.32, 10=0.141, 50=0.141, 100=0.064, 1000=0.044, 10000=0.034 (USD); Lead Free: 5697LeadFree; ComponentLink1URL: https://datasheet.ciiva.com/11808/0900766b80fe20f7-11808049.pdf?src-supplier=Rs; ComponentLink1Description: https://datasheet.ciiva.com/11808/0900766b80fe20f7-11808049.pdf?src-supplier=Rs; ComponentLink2URL: https://datasheet.ciiva.com/29183/450927-da-01-en-widerstand-0603-era-29183778.pdf?src-supplier=Conrad; ComponentLink2Description: https://datasheet.ciiva.com/29183/450927-da-01-en-widerstand-0603-era-29183778.pdf?src-supplier=Conrad; ComponentLink3URL: https://datasheet.ciiva.com/9196/aoa0000ce26-9196935.pdf?src-supplier=Avnet; ComponentLink3Description: https://datasheet.ciiva.com/9196/aoa0000ce26-9196935.pdf?src-supplier=Avnet; ComponentLink4URL: https://datasheet.ciiva.com/43457/485442-43457768.pdf?src-supplier=Farnell; ComponentLink4Description: https://datasheet.ciiva.com/43457/485442-43457768.pdf?src-supplier=Farnell; ComponentLink5URL: https://datasheet.ciiva.com/43455/485442-43455224.pdf?src-supplier=Farnell; ComponentLink5Description: https://datasheet.ciiva.com/43455/485442-43455224.pdf?src-supplier=Farnell; ComponentLink6URL: https://datasheet.ciiva.com/48530/era-eng-tds-48530485.pdf?src-supplier=Distrelec; ComponentLink6Description: https://datasheet.ciiva.com/48530/era-eng-tds-48530485.pdf?src-supplier=Distrelec; ComponentLink7URL: https://datasheet.ciiva.com/48425/era-eng-tds-48425448.pdf?src-supplier=Distrelec; ComponentLink7Description: https://datasheet.ciiva.com/48425/era-eng-tds-48425448.pdf?src-supplier=Distrelec; ComponentLink8URL: https://datasheet.ciiva.com/46422/485442-46422632.pdf?src-supplier=Element14; ComponentLink8Description: https://datasheet.ciiva.com/46422/485442-46422632.pdf?src-supplier=Element14; ComponentLink9URL: https://datasheet.ciiva.com/46422/485442-46422633.pdf?src-supplier=Element14; ComponentLink9Description: https://datasheet.ciiva.com/46422/485442-46422633.pdf?src-supplier=Element14; ComponentLink10URL: https://datasheet.ciiva.com/46422/485442-46422634.pdf?src-supplier=Element14; ComponentLink10Description: https://datasheet.ciiva.com/46422/485442-46422634.pdf?src-supplier=Element14; ComponentLink11URL: https://datasheet.ciiva.com/6000/485442-6000521.pdf?src-supplier=Farnell; ComponentLink11Description: https://datasheet.ciiva.com/6000/485442-6000521.pdf?src-supplier=Farnell; ComponentLink12URL: https://datasheet.ciiva.com/6000/485442-6000524.pdf?src-supplier=Farnell; ComponentLink12Description: https://datasheet.ciiva.com/6000/485442-6000524.pdf?src-supplier=Farnell
R8 = Y16278K40000T0W: Res SMD 8.4K Ohm 0.01% 1/2W 2010; Manufacturer: VPG Foil Resistors; Resistance: 8.4kR; Max Power Dissipation: 500mW; Temperature Coefficient: 0.2ppm/°C; Supplier 1: Avnet; Manufacturer Part Number: Y16278K40000T0W; RoHS: No; Category: Chip SMD Resistors; Pricing 1: 100=16.6732, 110=16.6732, 210=16.6732, 500=16.6732, 1000=16.6732, 5000=16.6732, 10000=16.6732 (USD); Case/Package: 2010; Case Code (Metric): 5025; Case Code (Imperial): 2010; Min Operating Temperature: -55°C; Max Operating Temperature: 150°C; Package Quantity: 1000; Packaging: Tray; Tolerance: 0.01%; Number of Terminations: 2; Features: Moisture Resistant; Series: VSMP; Length: 0.198inch; Width: 0.097inch; Height: 0.025inch; ComponentLink1URL: https://datasheet.ciiva.com/18612/vsmp-18612758.pdf?src-supplier=Digikey; ComponentLink1Description: https://datasheet.ciiva.com/18612/vsmp-18612758.pdf?src-supplier=Digikey
R9 = MCT06030C4001FP500: MCT Series Professional Thin Film Chip Resistor 0603 4K Ohm 1% Tolerance 0.125W ±50 ppm/K Surface Mount 2-Pin SMD...; Manufacturer: Vishay Beyschlag; Resistance: 4kR; Supplier 1: Digikey; Manufacturer Part Number: MCT06030C4001FP500; RoHS: Yes; Category: Chip SMD Resistors; Pricing 1: 5000=0.01939, 10000=0.0181, 25000=0.01719, 50000=0.01685, 125000=0.01648 (USD); RoHS Compliant: Yes; Lead Free: 5697LeadFree; ComponentLink1URL: http://www.vishay.com/docs/28705/mcx0x0xpro.pdf?src-supplier=Digikey; ComponentLink1Description: http://www.vishay.com/docs/28705/mcx0x0xpro.pdf?src-supplier=Digikey
R10 = CRCW060321K0FKEA: SMD Chip Resistor, 21 kOhm, ± 1%, 100 mW, 0603 [1608 Metric], Thick Film, General Purpose; Manufacturer: Vishay; Supplier 1: Mouser; Manufacturer Part Number: CRCW060321K0FKEA; RoHS: Yes; Category: Chip SMD Resistors; Stock 1: 22117; Pricing 1: 1=0.1, 10=0.017, 50=0.017, 100=0.01, 1000=0.008, 10000=0.004 (USD); Lead Free: 5697LeadFree; ComponentLink1URL: https://datasheet.ciiva.com/11811/0900766b80d98afc-11811922.pdf?src-supplier=Rs; ComponentLink1Description: https://datasheet.ciiva.com/11811/0900766b80d98afc-11811922.pdf?src-supplier=Rs; ComponentLink2URL: https://datasheet.ciiva.com/16757/70201119-16757801.pdf?src-supplier=Allied+Electronics; ComponentLink2Description: https://datasheet.ciiva.com/16757/70201119-16757801.pdf?src-supplier=Allied+Electronics; ComponentLink3URL: https://datasheet.ciiva.com/16507/dcrcwe3-16507926.pdf?src-supplier=Future+Electronics; ComponentLink3Description: https://datasheet.ciiva.com/16507/dcrcwe3-16507926.pdf?src-supplier=Future+Electronics; ComponentLink4URL: https://datasheet.ciiva.com/7173/1635184-7173014.pdf?src-supplier=Newark; ComponentLink4Description: https://datasheet.ciiva.com/7173/1635184-7173014.pdf?src-supplier=Newark; ComponentLink5URL: https://datasheet.ciiva.com/22870/70201119-22870809.pdf?src-supplier=Allied+Electronics; ComponentLink5Description: https://datasheet.ciiva.com/22870/70201119-22870809.pdf?src-supplier=Allied+Electronics; ComponentLink6URL: https://datasheet.ciiva.com/2494/dcrcwe3-2494528.pdf?src-supplier=Digikey; ComponentLink6Description: https://datasheet.ciiva.com/2494/dcrcwe3-2494528.pdf?src-supplier=Digikey; ComponentLink7URL: https://datasheet.ciiva.com/2494/dcrcwe3-2494529.pdf?src-supplier=Digikey; ComponentLink7Description: https://datasheet.ciiva.com/2494/dcrcwe3-2494529.pdf?src-supplier=Digikey; ComponentLink8URL: https://datasheet.ciiva.com/2494/dcrcwe3-2494530.pdf?src-supplier=Digikey; ComponentLink8Description: https://datasheet.ciiva.com/2494/dcrcwe3-2494530.pdf?src-supplier=Digikey; ComponentLink9URL: https://datasheet.ciiva.com/3257/dcrcwe3-3257255.pdf?src-supplier=Avnet; ComponentLink9Description: https://datasheet.ciiva.com/3257/dcrcwe3-3257255.pdf?src-supplier=Avnet; ComponentLink10URL: https://datasheet.ciiva.com/5548/dcrcwe3-109170-5548934.pdf?src-supplier=Mouser; ComponentLink10Description: https://datasheet.ciiva.com/5548/dcrcwe3-109170-5548934.pdf?src-supplier=Mouser; ComponentLink11URL: https://datasheet.ciiva.com/7663/1697337-7663909.pdf?src-supplier=Element14; ComponentLink11Description: https://datasheet.ciiva.com/7663/1697337-7663909.pdf?src-supplier=Element14; ComponentLink12URL: https://datasheet.ciiva.com/7663/1697337-7663910.pdf?src-supplier=Element14; ComponentLink12Description: https://datasheet.ciiva.com/7663/1697337-7663910.pdf?src-supplier=Element14
R11 = RC0603FR-07100RL: SMD Chip Resistor, 100 Ohm, ± 1%, 100 mW, 0603 [1608 Metric], Thick Film, General Purpose; Manufacturer: Yageo; Voltage Rating (DC): 50V; Resistance: 100R; Power Rating: 100mW; Temperature Coefficient: 100ppm/°C; Supplier 1: Future Electronics; Manufacturer Part Number: RC0603FR-07100RL; RoHS: Yes; Category: Chip SMD Resistors; Stock 1: 15275000; Pricing 1: 5000=0.0015, 50000=0.0014, 150000=0.0014, 375000=0.0013, 1000000=0.0012 (USD); Case/Package: 0603; Number of Pins: 2; Case Code (Imperial): 0603; Case Code (Metric): 1608; Size Code: 0603; Min Operating Temperature: -55°C; Max Operating Temperature: 155°C; Voltage Rating: 50V; Tolerance: 1%; Packaging: Tape and Reel; Series: RC; Termination: SMD/SMT; Resistance Tolerance: 1%; Max Power Dissipation: 100mW; Number of Terminations: 2; Technology: THICK FILM; Features: Moisture Resistant; Construction: Rectangular; Resistor Type: Thick Film; Length: 1.6mm; Width: 0.8mm; Height: 0.45mm; Depth: 0.8mm; Lead Free: Lead Free; RoHS Compliant: Yes; Reach SVHC Compliant: Unknown; Military Standard: Not